# EAGLE design Power-LDO-Regulator with TL431 and P-Mosfet (EAGLE 7.4.0)
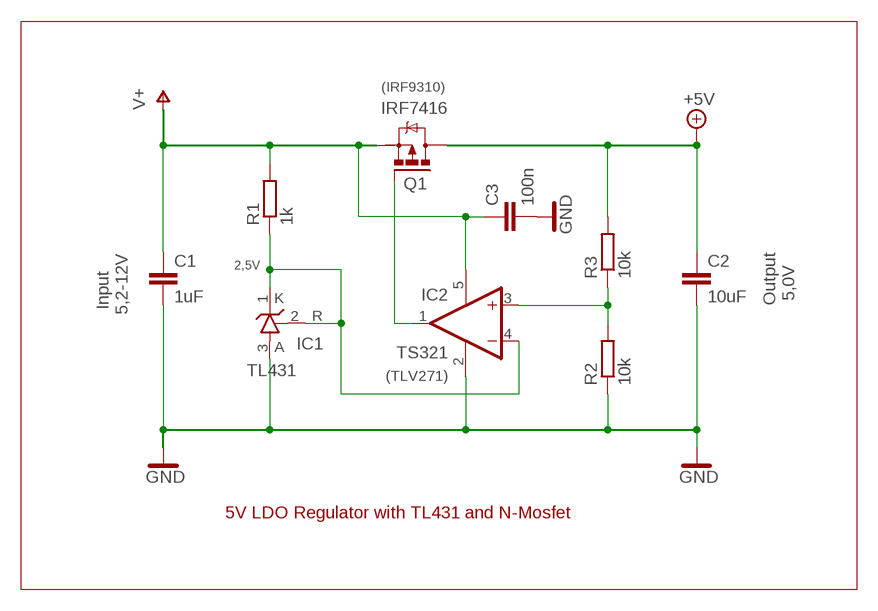
[diagram p0: schematic, sheet 1]

## Parts
C1  1uF  C-EUC0805  [C0805]
C2  10uF  C-EUC0805  [C0805]
C3  100n  C-EUC0603  [C0603]
IC1  TL431  TL431-SO23  [SOT23]
IC2  TS321  TS321SOT23-5  [SOT23-5]
Q1  IRF7416  P-MOSFET-SO8  [SO-08]
R1  1k  R-EU_R0603  [R0603]
R2  10k  R-EU_R0603  [R0603]
R3  10k  R-EU_R0603  [R0603]

## Nets
+5V: C2.1 Q1.5(D) Q1.6(D) Q1.7(D) Q1.8(D) R3.2
GND: C1.2 C2.2 C3.2 IC1.3(A) IC2.2(GND) R2.1
N$2: IC2.3(+IN) R2.2 R3.1
N$3: IC1.1(C) IC1.2(R) IC2.4(-IN) R1.1
N$4: IC2.1(OUT) Q1.4(G)
V+: C1.1 C3.1 IC2.5(V+) Q1.1(S) Q1.2(S) Q1.3(S) R1.2

## Notes on the sheet
- (IRF9310)
- 2,5V
- K
- Output
   5,0V
- Input
  5,2-12V
- R
- A
- (TLV271)
- 5V LDO Regulator with TL431 and N-Mosfet

## Library data of the parts
C1-C3 = rcl1:C-EU: CAPACITOR, European symbol
IC1 = v-reg:TL431-SO23: Spannungs-Referenz im SO23-Gehäuse
IC2 = linear-1:TS321: TS321 - Low Power Single-OP 3-30V im SOT23-5 Gehäuse
Q1 = transistor-power-1:P-MOSFET-SO8: P-Channel MOSFET Example: FDS4435A; P-Channel Logic Level PowerTrench® MOSFET FDS4465; P-Channel 1.8V Specified PowerTrench® MOSFET Source: www.fairchildsemi.com
R1-R3 = rcl1:R-EU_: RESISTOR, European symbol

## Board
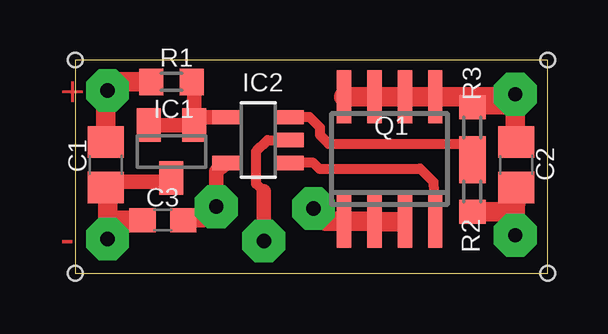
[diagram p1: board, top side]
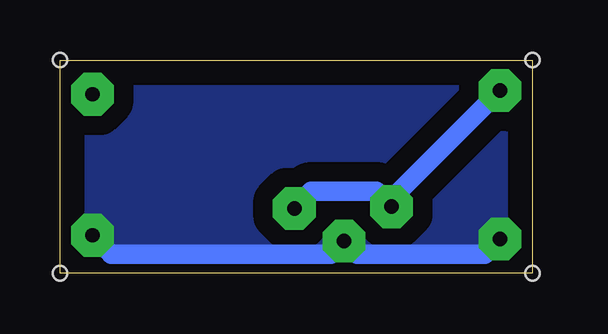
[diagram p2: board, bottom side, seen from below]

Size 19.68 x 8.89 mm. Coordinates in mm from the lower left corner, seen from the top.
Outline: 0,0 19.68,0 19.68,8.89 0,8.89 0,0
Copper layers (1*16): Top 0.035mm / dielectric 1.5mm / Bottom 0.035mm
Design rules "default": minimum track width 10mil, minimum drill 24mil, track to track 8mil, track to pad 8mil, pad to pad 8mil, via to via 8mil, smd to smd 8mil, copper to edge 40mil, drill to drill 8mil, minimum pad ring 10mil, minimum via ring 8mil, stop-mask expansion 4mil, vias tented up to drill 0mil, thermal gap 10mil
Holes 0.6 mm at 0,0 0,8.89 19.68,8.89 19.68,0

### Footprints (pad centres in the part's own frame; a part is rotated, then mirrored left to right if it is on the bottom)
C0805 = smd 1.3 x 1.5: 1 -0.95,0; 2 0.95,0
C0603 = smd 1.1 x 1: 1 -0.85,0; 2 0.85,0
SOT23 = smd 1 x 1.4: 1 -0.95,-1.1; 2 0.95,-1.1; 3 0,1.1
SOT23-5 = smd 0.6 x 1.2: 1 -0.95,-1.306; 2 0,-1.306; 3 0.95,-1.306; 4 0.95,1.306; 5 -0.95,1.306
SO-08 = smd 0.6 x 2.2: 1 -1.905,-2.6; 2 -0.635,-2.6; 3 0.635,-2.6; 4 1.905,-2.6; 5 1.905,2.6; 6 0.635,2.6; 7 -0.635,2.6; 8 -1.905,2.6
R0603 = smd 1 x 1.1: 1 -0.85,0; 2 0.85,0

### Placement (x,y rotation side)
C1  1.27,4.52 270 top
C2  18.38,4.52 270 top
C3  3.65,2.22 180 top
IC1  4.01,5.08 180 top
IC2  7.62,5.56 90 top
Q1  13.1,4.76 0 top
R1  4.01,7.98 180 top
R2  16.55,3.41 90 top
R3  16.55,6.07 90 top

### Tracks (layer width: path | path; a pad name or v marks a point on that pad's centre or on a via)
+5V  (via drill 0.6 pad 1.78)
  Top 0.61: C2.1 18.34,5.87 | R3.2 18.34,6.92 | 18.26,7.36 v18.34,7.46
  Top 0.813: 18.34,5.87 18.34,6.92 v18.34,7.46 18.34,7.36 Q1.5 Q1.6 Q1.7 Q1.8
GND  (via drill 0.6 pad 1.78)
  Top 0.406: 7.86,3.41 7.54,3.73 7.54,5.08 8.02,5.56 IC2.2
  Top 0.61: 3.83,3.57 IC1.3 3.93,3.82 1.28,3.82 C1.2 1.35,3.5 | C2.2 18.34,3.89 | 7.86,3.41 v7.86,1.35 | 1.35,1.91 1.35,2.22
  Top 0.813: R2.1 18.34,2.56 | 1.35,3.5 1.35,1.91 v1.35,1.43 | v18.34,1.59 18.34,2.56 | 18.34,2.56 18.38,3.71 C2.2 | 1.35,2.22 C3.2
  Bottom 0.813: v1.35,1.43 1.98,0.79 7.3,0.79 v7.86,1.35 8.41,0.79 17.54,0.79 v18.34,1.59
  pour Bottom (isolate 0.813): -0.32,-0.32 20,-0.32 20,9.21 -0.32,9.21
N$2
  Top 0: R2.2 R3.1
  Top 0.406: 16.37,5.4 10.56,5.4 10.2,5.75 10.2,6.07 9.76,6.51 8.85,6.51 IC2.3
  Top 0.61: 16.37,5.4 R3.1
N$3
  Top 0.61: R1.1 4.96,7.8 IC1.1 | IC1.2 IC1.1 | IC2.4 4.96,6.51 IC1.1
N$4
  Top 0.406: Q1.4 14.92,3.81 14.37,4.37 10.16,4.37 9.92,4.61 IC2.1
V+  (via drill 0.6 pad 1.78)
  Top 0.61: 1.35,5.55 C1.1 | IC2.5 5.87,4.25 v5.87,2.78 5.32,2.22 C3.1 | 13.57,2.14 13.57,2.16 Q1.3
  Top 0.813: C1.1 1.27,7.54 v1.35,7.62 1.71,7.98 R1.2 | v9.92,2.7 10.46,2.16 Q1.1 Q1.2 12.46,2.14 13.57,2.14
  Bottom 0.813: v1.35,7.62 5.87,3.1 v5.87,2.78 6.51,3.41 9.21,3.41 v9.92,2.7

### Text on the board
Top: + | -
tValues: + | R | K | A | Output / 5,0V | Input / 5,2-12V | -